# Altium schematic sheet Power_Diagram.SchDoc
size A4; SheetNumber: 3; SheetTotal: 8
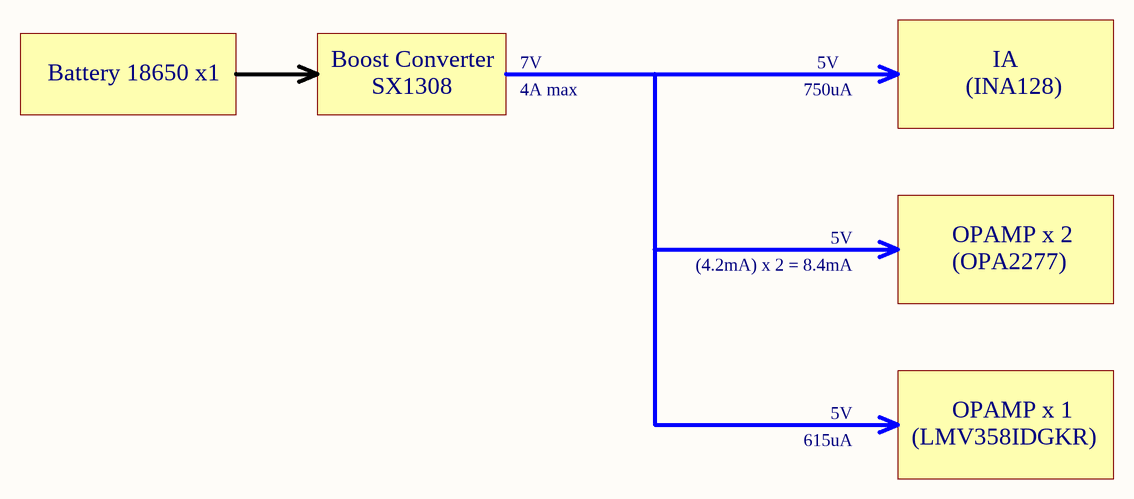
[diagram p0: Power_Diagram.SchDoc]

## Notes on the sheet
- Battery 18650 x1
- Boost Converter
- 7V
- 5V
- IA
- SX1308
- 4A max
- 750uA
- (INA128)
- (4.2mA) x 2 = 8.4mA
- OPAMP x 2
- (OPA2277)
- OPAMP x 1
- 615uA
- (LMV358IDGKR)
- Title:
- Date:
- Time:
- Drawn by:
- Phung Nhat Minh
- Sheet
- of